# Altium project Vreg_Learning_Platform_Version1.0.PrjPcb (part 6 of 6)

## Sheet User.SchDoc: <Project Name>
size A3; ApprovedBy: <Appr.>; Author: <Author>; CompanyName: Infineon Technologies AG; Engineer: <Rel.>; Organization: Infineon Technologies AG; Address1: IFAG DES S PS; Address2: Am Campeon 1-12  -  85579 Neubiberg  -  Germany; Address3: 85579 Neubiberg; Address4: Germany; DocumentNumber: 9; Revision: <Rev.>; SheetNumber: 9; SheetTotal: 9; Release: RC00; PageSetup: Record=PageOptions|CenterHorizontal=True|CenterVertical=True|PrintScale=1.01|XCorrection=1.00|YCorrection=1.00|PrintKind=0|BorderSize=5000000|LeftOffset=0|BottomOffset=0|Orientation=2|PaperLength=1000|PaperWidth=1000|Scale=100|PaperSource=7|PrintQuality=-4|MediaType=1|DitherType=10|PaperKind=A3|PrintScaleMode=1; Doc_ConfidentialStatus: <Doc_ConfidentialStatus>; Doc_Preliminary: <Doc_Preliminary>
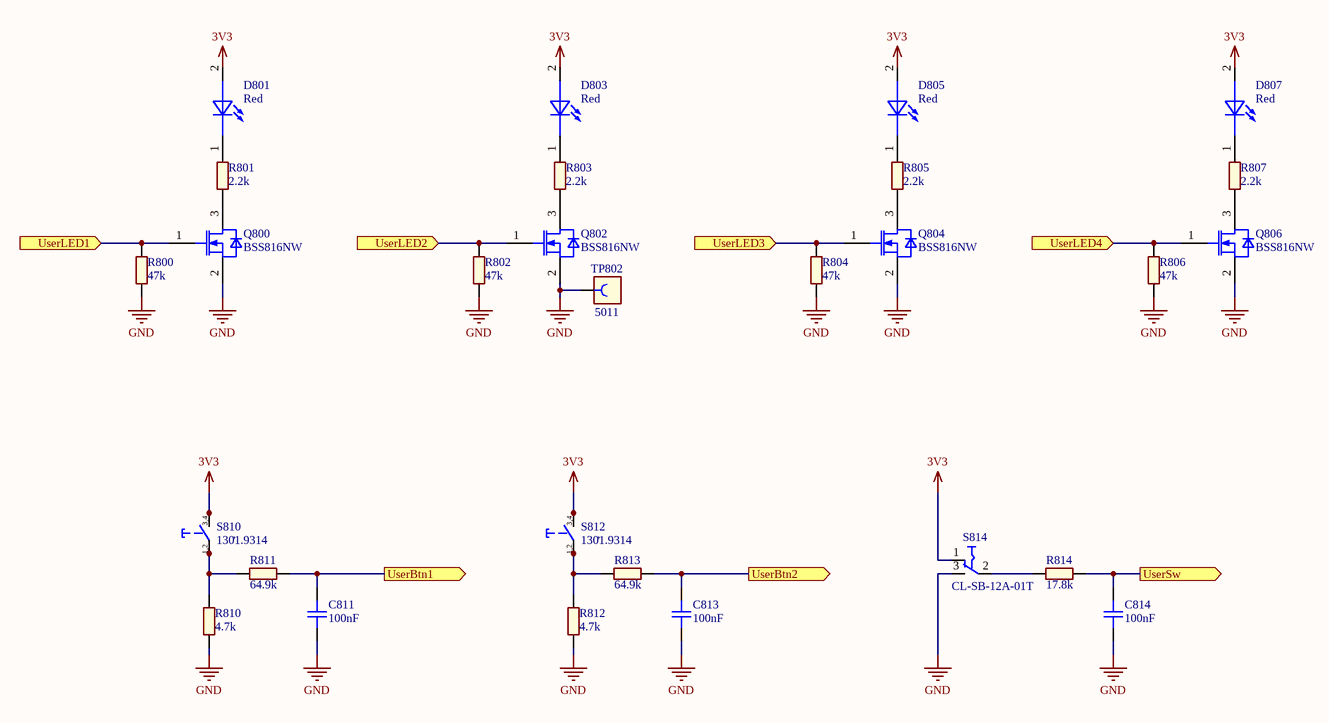
[diagram p7: User.SchDoc]

### Parts
C811  100nF  [CAPC1608X90N-2]
C813  100nF  [CAPC1608X90N-2]
C814  100nF  [CAPC1608X90N-2]
D801  Red  [LEDSC160X80X80-2N-1]
D803  Red  [LEDSC160X80X80-2N-1]
D805  Red  [LEDSC160X80X80-2N-1]
D807  Red  [LEDSC160X80X80-2N-1]
Q800  BSS816NW  [SOT65P210X100-3N-1-V]
Q802  BSS816NW  [SOT65P210X100-3N-1-V]
Q804  BSS816NW  [SOT65P210X100-3N-1-V]
Q806  BSS816NW  [SOT65P210X100-3N-1-V]
R800  47k  [RESC1609X50N]
R801  2.2k  [RESC1609X50N]
R802  47k  [RESC1609X50N]
R803  2.2k  [RESC1609X50N]
R804  47k  [RESC1609X50N]
R805  2.2k  [RESC1609X50N]
R806  47k  [RESC1609X50N]
R807  2.2k  [RESC1609X50N]
R810  4.7k  [RESC1609X50N]
R811  64.9k  [RESC1609X50N]
R812  4.7k  [RESC1609X50N]
R813  64.9k  [RESC1609X50N]
R814  17.8k  [RESC1609X50N]
S810  1301.9314  [SW-SMD-1301.9314]
S812  1301.9314  [SW-SMD-1301.9314]
S814  CL-SB-12A-01T  [SW-SMD-CL-SB-12A-01T]
TP802  5011  [CON-THT-TP-5011]

### Ports
UserBtn1 (out), UserBtn2 (out), UserLED1 (in), UserLED2 (in), UserLED3 (in), UserLED4 (in), UserSw (out)

### Nets
3V3: D801.2(Anode) D803.2(Anode) D805.2(Anode) D807.2(Anode) S810.3 S810.4 S812.3 S812.4 S814.1
GND: C811.1 C813.1 C814.1 Q800.2(SOURCE) Q802.2(SOURCE) Q804.2(SOURCE) Q806.2(SOURCE) R800.1 R802.1 R804.1 R806.1 R810.1 R812.1 S814.3 TP802.1
UserBtn1: C811.2 R811.1 ; port UserBtn1
UserBtn2: C813.2 R813.1 ; port UserBtn2
UserLED1: Q800.1(GATE) R800.2 ; port UserLED1
UserLED2: Q802.1(GATE) R802.2 ; port UserLED2
UserLED3: Q804.1(GATE) R804.2 ; port UserLED3
UserLED4: Q806.1(GATE) R806.2 ; port UserLED4
UserSw: C814.2 R814.1 ; port UserSw
NetD801_1: D801.1(Cathode) R801.1
NetD803_1: D803.1(Cathode) R803.1
NetD805_1: D805.1(Cathode) R805.1
NetD807_1: D807.1(Cathode) R807.1
NetQ800_3: Q800.3(DRAIN) R801.2
NetQ802_3: Q802.3(DRAIN) R803.2
NetQ804_3: Q804.3(DRAIN) R805.2
NetQ806_3: Q806.3(DRAIN) R807.2
NetR810_2: R810.2 R811.2 S810.1 S810.2
NetR812_2: R812.2 R813.2 S812.1 S812.2
NetR814_2: R814.2 S814.2

### Notes on the sheet
- ,
- Title
- Variant
- Approved
- Date:
- Author:
- Size:
- A3
- Document Name
- Time:
- SVN Revision:
- Rel.
- Rev.
- Sheet
- of
- (in symbol 380147) 3,4; 1,2

### Library data of the parts
C811 C813 C814 = 479045: CAP / CERA / 100nF / 50V / 10% / X7R (EIA) / -55°C to 125°C / 0603 / SMD / -; Multiple Parts: No; Manufacturer: AVX; Manufacturer Order Number: 06035C104KAT2A; Symbol Type: Capacitor; Single; Standard; 2 Pins; Alternate View: Yes; Article Number: 479045; Version Number: V01; Combined Parameters: TC:X7R (EIA);Tol.:-10%/+10%;Vdc:50V; QuickPick: 100nF / 50V / 10% / X7R (EIA) / 0603; Type: Standard; Style: Single; ComponentStatus: Released; PLMStatus: Active; Part Type: Capacitor; Value: 100nF; Tolerance Neg: 10%; Tolerance Pos: 10%; Application: Standard; Technology: Ceramic; Temperature min: -55; Temperature max: 125; Temperature Range: Military; ROHS Compliant: Y; Automotive Qualified: No; PackageReference: 0603; ComponentLink1Description: Vendor WebSite; ComponentLink1URL: http://www.avx.com; ComponentLink2Description: Datasheet; ComponentLink2URL: http://webnetprod.muc.infineon.com/PCBPortal_Prod/WorkFlows/AltiumComponent/StandardDocumentation?Versionid=479046; Supplier 1: Farnell; Supplier Part Number 1: 2280883; Supplier 2: DigiKey; Supplier Part Number 2: 478-5052-2-ND; Supplier 3: Mouser; Supplier Part Number 3: 581-06035C104KAT2A; Second Source allowed: Yes; Voltage DC (max): 50V; Package Description: Capacitor,non-polarized,Chip;1.60mm L X 0.81mm W X 0.90mm H
D801 D803 D805 D807 = 625459: as D550-D553 on sheet Safety; Part Type: Diode; Value: Red; Type: LED; Application: Standard; Temperature min: -40; Temperature max: 85; Temperature Range: Industrial; ROHS Compliant: Y; PackageReference: 1608 (0603); ComponentLink1Description: Vendor WebSite; ComponentLink1URL: http://www.we-online.com; ComponentLink2Description: Datasheet; ComponentLink2URL: http://webnetprod.muc.infineon.com/PCBPortal_Prod/WorkFlows/AltiumComponent/StandardDocumentation?Versionid=625460; Supplier 1: Farnell; Supplier Part Number 1: 2322071; Supplier 2: DigiKey; Supplier Part Number 2: 732-4978-1-ND; Supplier 3: Mouser; Supplier Part Number 3: 710-150060RS75000; Package Description: LED,Side Concave; 2 pin,1.60mm W X 0.80mm L X 0.80mm H
Q800 Q802 Q804 Q806 = 644598: as Q550-Q553 on sheet Safety; Part Type: Transistor FET; Manufacturer Order Number: BSS816NW; Value: BSS816NW; Application: Small Signal; Temperature min: -55; Temperature max: 150; Temperature Range: Military; ROHS Compliant: Y; PackageReference: PG-SOT323-3-2; ComponentLink1Description: Vendor WebSite; ComponentLink1URL: https://www.infineon.com/; ComponentLink2Description: Datasheet; ComponentLink2URL: http://webnetprod.muc.infineon.com/PCBPortal_Prod/WorkFlows/AltiumComponent/StandardDocumentation?Versionid=644599; Supplier 1: Farnell; Supplier Part Number 1: 2617470; Supplier 2: DigiKey; Supplier Part Number 2: BSS816NWH6327XTSA1CT-ND; Supplier 3: Mouser; Supplier Part Number 3: 726-SP000917562; Package Description: SOT,0.65mm pitch;3 pin,1.25mm W X 2.00mm L X 1.00mm H body
R800 R802 R804 R806 = 346552: RES / STD / 47k / 100mW / 1% / 100ppm/K / -55°C to 155°C / 0603 / SMD / -; Multiple Parts: No; Legacy PartNumber: RES01801333; Manufacturer: Vishay; Manufacturer Order Number: CRCW060347K0FK; Symbol Type: Resistor; Single; Standard; 2 Pins; Alternate View: Yes; Article Number: 346552; Version Number: V01; Combined Parameters: TCR:100ppm/K;Tol.:-1%/+1%;Vdc:75V;Idc:-;P:100mW; QuickPick: 47k / 1% / 0.1 / 0603; Style: Single; Automotive Qualified: AEC Q200; ComponentStatus: Released; PLMStatus: Active; Voltage DC (max): 75V; Legacy DeviceID: RES01801333; Part Type: Resistor; Value: 47k; Tolerance Neg: 1%; Tolerance Pos: 1%; Type: Standard; Technology: Thick Film; Temperature min: -55; Temperature max: 155; Temperature Range: Military; ROHS Compliant: Y; PackageReference: 0603; ComponentLink1Description: Vendor WebSite; ComponentLink1URL: http://www.vishay.com; ComponentLink2Description: Datasheet; ComponentLink2URL: http://webnetprod.muc.infineon.com/PCBPortal_Prod/WorkFlows/AltiumComponent/StandardDocumentation?Versionid=346553; Supplier 1: Farnell; Supplier 2: DigiKey; Supplier Part Number 2: 541-47.0KHCT-ND; Supplier 3: Mouser; Second Source allowed: Yes
R801 R803 R805 R807 = 345782: as R550-R553 on sheet Safety; Legacy DeviceID: RES01801179; Part Type: Resistor; Value: 2.2k; Tolerance Neg: 1%; Tolerance Pos: 1%; Type: Standard; Technology: Thick Film; Temperature min: -55; Temperature max: 155; Temperature Range: Military; ROHS Compliant: Y; PackageReference: 0603; ComponentLink1Description: Vendor WebSite; ComponentLink1URL: http://www.vishay.com; ComponentLink2Description: Datasheet; ComponentLink2URL: http://webnetprod.muc.infineon.com/PCBPortal_Prod/WorkFlows/AltiumComponent/StandardDocumentation?Versionid=345783; Supplier 1: Farnell; Supplier 2: DigiKey; Supplier 3: Mouser; Second Source allowed: Yes
R810 R812 = 345982: RES / STD / 4.7k / 100mW / 1% / 100ppm/K / -55°C to 155°C / 0603 / SMD / -; Multiple Parts: No; Legacy PartNumber: RES01801219; Manufacturer: Vishay; Manufacturer Order Number: CRCW06034K70FK; Symbol Type: Resistor; Single; Standard; 2 Pins; Alternate View: Yes; Article Number: 345982; Version Number: V01; Combined Parameters: TCR:100ppm/K;Tol.:-1%/+1%;Vdc:75V;Idc:-;P:100mW; QuickPick: 4.7k / 1% / 0.1 / 0603; Style: Single; Automotive Qualified: AEC Q200; ComponentStatus: Released; PLMStatus: Active; Voltage DC (max): 75V; Legacy DeviceID: RES01801219; Part Type: Resistor; Value: 4.7k; Tolerance Neg: 1%; Tolerance Pos: 1%; Type: Standard; Technology: Thick Film; Temperature min: -55; Temperature max: 155; Temperature Range: Military; ROHS Compliant: Y; PackageReference: 0603; ComponentLink1Description: Vendor WebSite; ComponentLink1URL: http://www.vishay.com; ComponentLink2Description: Datasheet; ComponentLink2URL: http://webnetprod.muc.infineon.com/PCBPortal_Prod/WorkFlows/AltiumComponent/StandardDocumentation?Versionid=345983; Supplier 1: Farnell; Supplier 2: DigiKey; Supplier 3: Mouser; Second Source allowed: Yes
R811 R813 = 346637: RES / STD / 64.9k / 100mW / 1% / 100ppm/K / -55°C to 155°C / 0603 / SMD / -; Multiple Parts: No; Legacy PartNumber: RES01801350; Manufacturer: Vishay; Manufacturer Order Number: CRCW060364K9FK; Symbol Type: Resistor; Single; Standard; 2 Pins; Alternate View: Yes; Article Number: 346637; Version Number: V01; Combined Parameters: TCR:100ppm/K;Tol.:-1%/+1%;Vdc:75V;Idc:-;P:100mW; QuickPick: 64.9k / 1% / 0.1 / 0603; Style: Single; Automotive Qualified: AEC Q200; ComponentStatus: Released; PLMStatus: Active; Voltage DC (max): 75V; Legacy DeviceID: RES01801350; Part Type: Resistor; Value: 64.9k; Tolerance Neg: 1%; Tolerance Pos: 1%; Type: Standard; Technology: Thick Film; Temperature min: -55; Temperature max: 155; Temperature Range: Military; ROHS Compliant: Y; PackageReference: 0603; ComponentLink1Description: Vendor WebSite; ComponentLink1URL: http://www.vishay.com; ComponentLink2Description: Datasheet; ComponentLink2URL: http://webnetprod.muc.infineon.com/PCBPortal_Prod/WorkFlows/AltiumComponent/StandardDocumentation?Versionid=346638; Supplier 1: Farnell; Supplier 2: DigiKey; Supplier 3: Mouser; Second Source allowed: Yes
R814 = 346302: RES / STD / 17.8k / 100mW / 1% / 100ppm/K / -55°C to 155°C / 0603 / SMD / -; Multiple Parts: No; Legacy PartNumber: RES01801283; Manufacturer: Vishay; Manufacturer Order Number: CRCW060317K8FK; Symbol Type: Resistor; Single; Standard; 2 Pins; Alternate View: Yes; Article Number: 346302; Version Number: V01; Combined Parameters: TCR:100ppm/K;Tol.:-1%/+1%;Vdc:75V;Idc:-;P:100mW; QuickPick: 17.8k / 1% / 0.1 / 0603; Style: Single; Automotive Qualified: AEC Q200; ComponentStatus: Released; PLMStatus: Active; Voltage DC (max): 75V; Legacy DeviceID: RES01801283; Part Type: Resistor; Value: 17.8k; Tolerance Neg: 1%; Tolerance Pos: 1%; Type: Standard; Technology: Thick Film; Temperature min: -55; Temperature max: 155; Temperature Range: Military; ROHS Compliant: Y; PackageReference: 0603; ComponentLink1Description: Vendor WebSite; ComponentLink1URL: http://www.vishay.com; ComponentLink2Description: Datasheet; ComponentLink2URL: http://webnetprod.muc.infineon.com/PCBPortal_Prod/WorkFlows/AltiumComponent/StandardDocumentation?Versionid=346303; Supplier 1: Farnell; Supplier 2: DigiKey; Supplier 3: Mouser; Second Source allowed: Yes
S810 S812 = 380147: Pushbutton Tactile Switch, Single Pole Single Throw, 4 Pins; Legacy PartNumber: CON01500305; Manufacturer: Schurter; Symbol type: Tactile Switch, Spring Return, Single Pole Single Throw - Normally Open, 4 Pins; Article Number: 380147; Version Number: V01; Legacy DeviceID: SCH_1301.9314; ComponentStatus: Released; PLMStatus: Active; Second Source allowed: Yes; Voltage DC (max): na; Part Type: Electro Mechanic; Manufacturer Order Number: 1301.9314; Value: 1301.9314; Temperature min: -20; Temperature max: 70; Temperature Range: Commercial; ROHS Compliant: Y; ComponentLink1Description: Vendor WebSite; ComponentLink1URL: http://www.schurter.com.sg/; ComponentLink2Description: Datasheet; ComponentLink2URL: http://webnetprod.muc.infineon.com/PCBPortal_Prod/WorkFlows/AltiumComponent/StandardDocumentation?Versionid=380148; Supplier 1: Farnell; Supplier Part Number 1: 1217763; Supplier 2: DigiKey; Supplier Part Number 2: 1301.9314-ND; Supplier 3: Mouser; Supplier Part Number 3: 693-1301.9314; Package Description: SMD Switch, 6.00mm L X 6.00mm W X 4.3mm H body
S814 = 650099: as S750-S752 on sheet Output; Part Type: Electro Mechanic; Manufacturer Order Number: CL-SB-12A-01T; Value: CL-SB-12A-01T; Application: Power; Temperature min: -40; Temperature max: 85; Temperature Range: Industrial; ROHS Compliant: Y; ComponentLink1Description: Vendor WebSite; ComponentLink1URL: www.copal-electronics.com/; ComponentLink2Description: Datasheet; ComponentLink2URL: http://webnetprod.muc.infineon.com/PCBPortal_Prod/WorkFlows/AltiumComponent/StandardDocumentation?Versionid=650100; Supplier 1: Farnell; Supplier Part Number 1: 2854744; Supplier 2: DigiKey; Supplier Part Number 2: 563-1314-1-ND; Supplier 3: Mouser; Supplier Part Number 3: 229-CL-SB-12A-01T; Package Description: Switch, SMD, 3 Pins, 3.50 mm W X 8.50 mm L X 6.10 mm H body
TP802 = 382410: PC Test Point-Multipurpose THT, Black; Multiple Parts: No; Legacy PartNumber: CON01500530; Manufacturer: Keystone Electronics Corp.; Symbol Type: Connector, 1 Lead, Female; Alternate View: Yes; Article Number: 382410; Version Number: V01; Legacy DeviceID: KEY_5011; Combined Parameters: Board-to-Cable None (onboard);1x1;Mounting:THT;Orient:0° (vertical);Shielded:No; QuickPick: 0° (vertical) / Board-to-Cable; Style: Not Applicable; ComponentStatus: Released; PLMStatus: Active; Voltage DC (max): na; Part Type: Connector; Manufacturer Order Number: 5011; Value: 5011; Type: Board-to-Cable; Application: Test; Temperature min: 0; Temperature max: 0; Temperature Range: Military; ROHS Compliant: Y; Automotive Qualified: No; ComponentLink1Description: Vendor WebSite; ComponentLink1URL: http://www.keyelco.com/; ComponentLink2Description: Datasheet; ComponentLink2URL: http://webnetprod.muc.infineon.com/PCBPortal_Prod/WorkFlows/AltiumComponent/StandardDocumentation?Versionid=382411; Supplier 1: Farnell; Supplier Part Number 1: 2431148; Supplier 2: DigiKey; Supplier Part Number 2: 36-5011-ND; Supplier 3: Mouser; Supplier Part Number 3: 534-5011; Second Source allowed: Yes; Package Description: Test Point, 1.78 mm Lead Width, Round, 3.17 mm Dia X 8.28 mm H body

## Nets that join several sheets
3V3: 02_Top_Level (6 pins), PowerSupply (C311.2 C312.2 D340.2 G310.3), Safety (34 pins), Output (6 pins), CurrentSensors (C610.2 C620.2 U610.3 U620.5), User (9 pins)
12V: 02_Top_Level (X110.8A X140.2), PowerStage (8 pins), PowerSupply (8 pins), Output (D741.2 D743.2 D745.2), CurrentSensors (C600.2 C630.2 U600.3 U630.7)
GND: 02_Top_Level (15 pins), Input (15 pins), PowerStage (6 pins), PowerSupply (16 pins), Safety (46 pins), Output (21 pins), CurrentSensors (12 pins), User (15 pins)
Out_neg: 02_Top_Level (R103.1 X103.1), Output (9 pins)
~{Cntrl1}: 02_Top_Level (JP125.2), Output (D740.2)
~{Cntrl2}: 02_Top_Level (JP126.2), Output (D742.2)
~{Cntrl3}: 02_Top_Level (JP127.2), Output (D744.2)
~{Shutdown}: 02_Top_Level (R112.1), PowerStage (U400.2 U430.2), Safety (U570.1)
Boost_Cntrl: 02_Top_Level (JP124.2), PowerStage (U430.1)
Buck_Cntrl: 02_Top_Level (JP122.2 Q124.1 R122.2), PowerStage (U400.1)
Curr_In+: Input (R211.4), CurrentSensors (U600.4)
Curr_In-: Input (R211.3), CurrentSensors (U600.5)
Curr_Inductor+: PowerStage (R420.3), CurrentSensors (U610.1)
Curr_Inductor-: PowerStage (R420.4), CurrentSensors (U610.8)
Curr_Out+: 02_Top_Level (R103.3), Safety (R515.1), CurrentSensors (R631.1 TP601.1)
Curr_Out-: 02_Top_Level (R103.4), Safety (C514.1 R514.2), CurrentSensors (R633.1 TP602.1)
Inductor_Current: 02_Top_Level (R132.2 X140.9), CurrentSensors (TP610.1 U610.4)
Inductor_Overcurr: 02_Top_Level (JP112.5), CurrentSensors (TP612.1 U610.2)
Input_Current: 02_Top_Level (R110.2 X140.5), Safety (R506.1), CurrentSensors (TP600.1 U600.6)
Load1: 02_Top_Level (X150.3 X150.4), Output (Q741.5 Q741.6 Q741.7 Q741.8)
Load2: 02_Top_Level (X150.5 X150.6), Output (Q743.5 Q743.6 Q743.7 Q743.8)
Load3: 02_Top_Level (X150.7 X150.8), Output (Q745.5 Q745.6 Q745.7 Q745.8)
NTC_ext: 02_Top_Level (JP120.1 X150.9), Safety (C533.2 R532.2 TP532.1 U520.4)
NTC_int: 02_Top_Level (JP120.3), Safety (5 pins)
Output_Current: 02_Top_Level (R111.2 X140.6), Safety (R507.1), CurrentSensors (R634.2 TP630.1 U630.6)
SW_Curr+: PowerStage (R421.3), Safety (R511.1), CurrentSensors (R621.2 TP621.1)
SW_Curr-: PowerStage (R421.4), Safety (C510.1 R510.2), CurrentSensors (R622.2 TP622.1)
SW_Current: 02_Top_Level (R131.2 X140.10), CurrentSensors (TP620.1 U620.1)
UserBtn1: 02_Top_Level (JP112.7), User (C811.2 R811.1)
UserBtn2: 02_Top_Level (JP112.15), User (C813.2 R813.1)
UserLED1: 02_Top_Level (JP112.9 JP125.1), User (Q800.1 R800.2)
UserLED2: 02_Top_Level (JP112.11 JP126.1), User (Q802.1 R802.2)
UserLED3: 02_Top_Level (JP111.7 JP127.1), User (Q804.1 R804.2)
UserLED4: 02_Top_Level (JP111.11), User (Q806.1 R806.2)
UserSw: 02_Top_Level (JP111.9), User (C814.2 R814.1)
Vin: 02_Top_Level (X140.11), Input (8 pins), PowerStage (5 pins)
Vin_Meas: 02_Top_Level (D111.1 JP110.7), Input (C221.2 R220.2 R221.2 TP220.1)
Vin_Raw: 02_Top_Level (X100.1), Input (Q200.2 TP200.1)
Vin_VoltReg: 02_Top_Level (X140.1), Input (6 pins), PowerSupply (5 pins)
Vout: 02_Top_Level (X102.1 X140.12 X150.1 X150.2), PowerStage (5 pins), Output (10 pins)
Vout_Meas: 02_Top_Level (D111.2 JP110.9), Safety (U500.7), Output (C722.2 R721.2 R722.2 TP721.1)

## Assembly variants
Default_Assembly: not fitted C210 C511 C515 JP421 MP100 MP101 MP102 MP103 R509 R513 X110
OnlySMD: not fitted C210 C511 C515 JP110 JP111 JP112 JP120 JP121 JP122 JP123 JP124 JP125 JP126 JP127 JP130 JP421 JP710 MP100 MP101 MP102 MP103 R509 R513 TP103 TP202 TP300 TP421 TP503 TP710 TP802 X110 X140 X150 X720